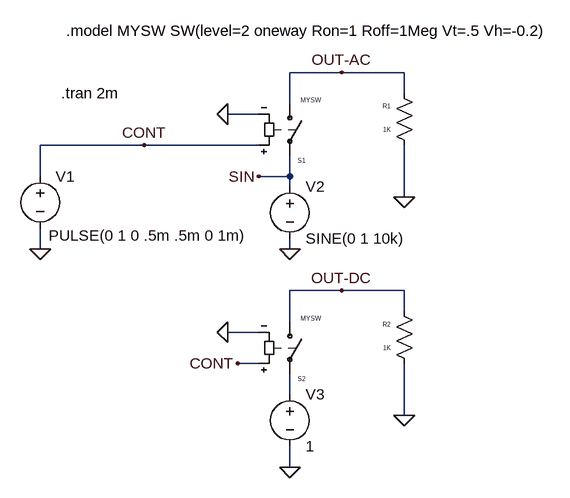
[diagram p0: schematic Fig_2-137_Vswitch_Level2_OneWay.asc]
Fig_2-137_Vswitch_Level2_OneWay.asc, the LTspice schematic file:
Version 4
SHEET 1 1276 840
WIRE 272 144 192 144
WIRE 368 144 272 144
WIRE 368 176 368 144
WIRE 192 192 192 144
WIRE 144 208 96 208
WIRE -32 256 -192 256
WIRE 144 256 -32 256
WIRE -192 304 -192 256
WIRE 192 304 192 272
WIRE 192 304 144 304
WIRE 192 320 192 304
WIRE 368 336 368 256
WIRE -192 416 -192 384
WIRE 192 416 192 400
WIRE 272 480 192 480
WIRE 368 480 272 480
WIRE 368 512 368 480
WIRE 192 528 192 480
WIRE 144 544 96 544
WIRE 144 592 112 592
WIRE 192 640 192 608
WIRE 368 672 368 592
WIRE 192 752 192 720
FLAG 368 336 0
FLAG 192 416 0
FLAG 96 208 0
FLAG -192 416 0
FLAG 272 144 OUT-AC
FLAG 368 672 0
FLAG 192 752 0
FLAG 96 544 0
FLAG 272 480 OUT-DC
FLAG -32 256 CONT
FLAG 112 592 CONT
FLAG 144 304 SIN
SYMBOL sw 192 176 R0
WINDOW 0 12 104 Left 0
WINDOW 3 17 11 Left 0
SYMATTR InstName S1
SYMATTR Value MYSW
SYMBOL voltage -192 288 R0
WINDOW 3 13 107 Left 2
SYMATTR Value PULSE(0 1 0 .5m .5m 0 1m)
SYMATTR InstName V1
SYMBOL voltage 192 304 R0
WINDOW 123 0 0 Left 0
WINDOW 39 0 0 Left 0
SYMATTR InstName V2
SYMATTR Value SINE(0 1 10k)
SYMBOL res 384 272 R180
WINDOW 0 36 76 Left 0
WINDOW 3 36 40 Left 0
SYMATTR InstName R1
SYMATTR Value 1K
SYMBOL sw 192 512 R0
WINDOW 0 12 104 Left 0
WINDOW 3 17 11 Left 0
SYMATTR InstName S2
SYMATTR Value MYSW
SYMBOL voltage 192 624 R0
WINDOW 123 0 0 Left 0
WINDOW 39 0 0 Left 0
SYMATTR InstName V3
SYMATTR Value 1
SYMBOL res 384 608 R180
WINDOW 0 36 76 Left 0
WINDOW 3 36 40 Left 0
SYMATTR InstName R2
SYMATTR Value 1K
TEXT -152 80 Left 2 !.model MYSW SW(level=2 oneway Ron=1 Roff=1Meg Vt=.5 Vh=-0.2)
TEXT -160 176 Left 2 !.tran 2m

The netlist it stands for:
* Fig_2-137_Vswitch_Level2_OneWay.asc
S1 OUT-AC SIN CONT 0 MYSW
V1 CONT 0 PULSE(0 1 0 .5m .5m 0 1m)
V2 SIN 0 SINE(0 1 10k)
R1 0 OUT-AC 1K
S2 OUT-DC N001 CONT 0 MYSW
V3 N001 0 1
R2 0 OUT-DC 1K
.model MYSW SW(level=2 oneway Ron=1 Roff=1Meg Vt=.5 Vh=-0.2)
.tran 2m
.backanno
.end